# Altium schematic sheet Urukul_Supply.SchDoc: Fastino (part 1 of 2)
size 420 x 297 mm; EDA_Number: ARTIQ; Projet: Zotino; Author: G.Kasprowicz; CompanyName: WUT ISE; DrawnBy: G.Kasprowicz; Organization: WUT ISE; Address1: PW ISE; Address2: Nowowiejska 15/19 00-665 Warsaw; Address3: gkasprow@gmail.com; DocumentNumber: 7; Revision: 2; SheetNumber: 3; SheetTotal: 11; ModifiedBy: -; CheckedDate: -; Title2: Power Supply; DivGrp: WUT ISE; Designer: G.Kasprowicz; SPICEModelCacheRGNJYCWR: <root> / <DocumentId>RGNJYCWR</DocumentId> / </root>; ModifiedDate: -; ProjectName: Sensor Box
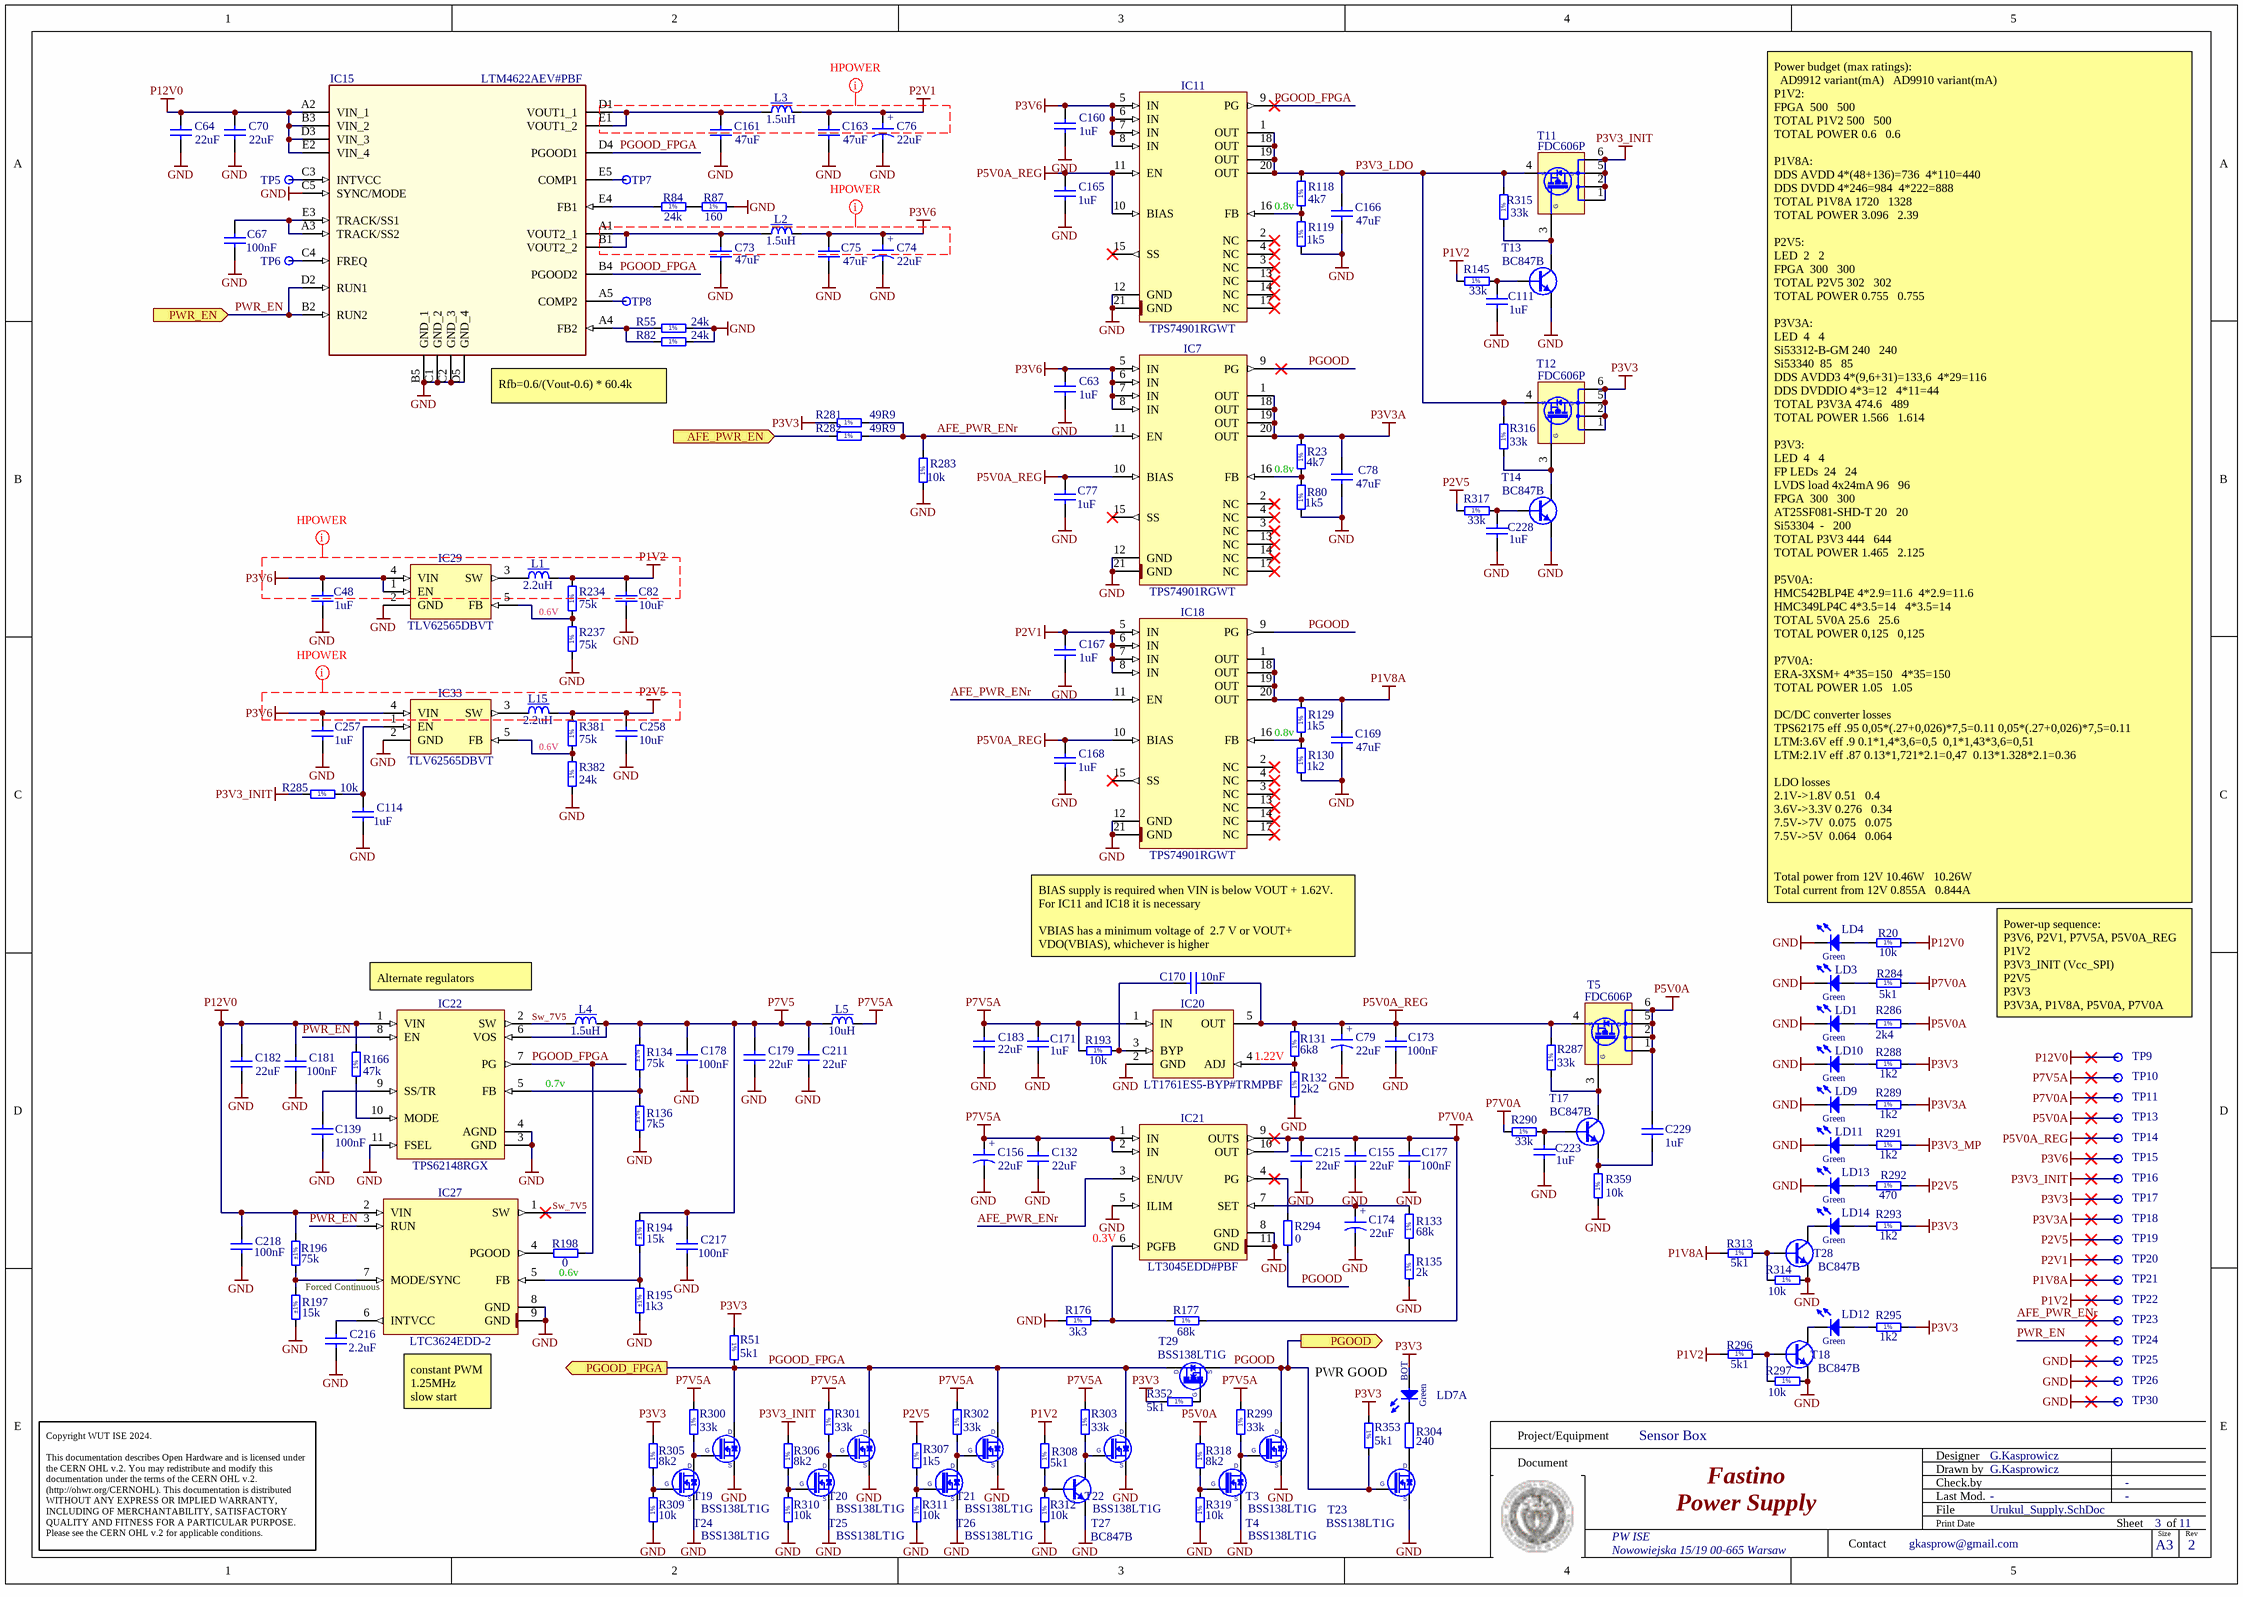
[diagram p0: Urukul_Supply.SchDoc]

## Parts
C48  1uF  [CAPC1005X55N]
C63  1uF  [CAPC1005X55N]
C64  22uF  [CAPC2012X135N]
C67  100nF  [CAPC1005X55N]
C70  22uF  [CAPC2012X135N]
C73  47uF  [CAPC3225X270N]
C74  22uF  [CAPMP3528X210N]
C75  47uF  [CAPC3225X270N]
C76  22uF  [CAPMP3528X210N]
C77  1uF  [CAPC1005X55N]
C78  47uF  [CAPC3225X270N]
C79  22uF  [CAPMP3528X210N]
C82  10uF  [CAPC2012X135N]
C111  1uF  [CAPC1608X87N]
C114  1uF  [CAPC1608X87N]
C132  22uF  [CAPC2012X135N]
C139  100nF  [CAPC1005X55N]
C155  22uF  [CAPC2012X135N]
C156  22uF  [CAPMP3528X210N]
C160  1uF  [CAPC1005X55N]
C161  47uF  [CAPC3225X270N]
C163  47uF  [CAPC3225X270N]
C165  1uF  [CAPC1005X55N]
C166  47uF  [CAPC3225X270N]
C167  1uF  [CAPC1005X55N]
C168  1uF  [CAPC1005X55N]
C169  47uF  [CAPC3225X270N]
C170  10nF  [CAPC1005X55N]
C171  1uF  [CAPC1005X55N]
C173  100nF  [CAPC1005X55N]
C174  22uF  [CAPMP3528X210N]
C177  100nF  [CAPC1005X55N]
C178  100nF  [CAPC1005X55N]
C179  22uF  [CAPC2012X135N]
C181  100nF  [CAPC1005X55N]
C182  22uF  [CAPC2012X135N]
C183  22uF  [CAPC2012X135N]
C211  22uF  [CAPC2012X135N]
C215  22uF  [CAPC2012X135N]
C216  2.2uF  [CAPC1005X55N]
C217  100nF  [CAPC1005X55N]
C218  100nF  [CAPC1005X55N]
C223  1uF  [CAPC1608X87N]
C228  1uF  [CAPC1608X87N]
C229  1uF  [CAPC1005X55N]
C257  1uF  [CAPC1005X55N]
C258  10uF  [CAPC2012X135N]
IC7  TPS74901RGWT  [QFN65P500X500X100-21N-S325]
IC11  TPS74901RGWT  [QFN65P500X500X100-21N-S325]
IC15  LTM4622AEV#PBF  [LGA25C127P5X5_625X625X190]
IC18  TPS74901RGWT  [QFN65P500X500X100-21N-S325]
IC20  LT1761ES5-BYP#TRMPBF  [SOT95P280X100-5N]
IC21  LT3045EDD#PBF  [SON50P300X300X80-11N-R175X248]
IC22  TPS62148RGX  [TEXAS_RGX0011A]
IC27  LTC3624EDD-2  [SON50P300X300X80-9N-R175X248]
IC29  TLV62565DBVT  [SOT95P280X145-5N]
IC33  TLV62565DBVT  [SOT95P280X145-5N]
L1  2.2uH  [IND_MURATA_LQH44PN_P0]
L2  1.5uH  [IND_TDK_SPM6530]
L3  1.5uH  [IND_TDK_SPM6530]
L4  1.5uH  [IND_TDK_SPM6530]
L5  10uH  [IND_MURATA-PS_8400]
L15  2.2uH  [IND_MURATA_LQH44PN_P0]
LD1  Green  [LED_KINGBRIGHT_KPH-1608CGCK]
LD3  Green  [LED_KINGBRIGHT_KPH-1608CGCK]
LD4  Green  [LED_KINGBRIGHT_KPH-1608CGCK]
LD7  Red/Green  [LED_DIALIGHT_571-0112F]  (value not drawn)  (part A of 2)
LD9  Green  [LED_KINGBRIGHT_KPH-1608CGCK]
LD10  Green  [LED_KINGBRIGHT_KPH-1608CGCK]
LD11  Green  [LED_KINGBRIGHT_KPH-1608CGCK]
LD12  Green  [LED_KINGBRIGHT_KPH-1608CGCK]
LD13  Green  [LED_KINGBRIGHT_KPH-1608CGCK]
LD14  Green  [LED_KINGBRIGHT_KPH-1608CGCK]
R20  10k  [RESC1005X40N]
R23  4k7  [RESC1608X55N]
R51  5k1  [RESC1005X40N]
R55  24k  [RESC1608X55N]
R80  1k5  [RESC1608X55N]
R82  24k  [RESC1608X55N]
R84  24k  [RESC1608X55N]
R87  160  [RESC1608X55N]
R118  4k7  [RESC1608X55N]
R119  1k5  [RESC1608X55N]
R129  1k5  [RESC1608X55N]
R130  1k2  [RESC1608X55N]
R131  6k8  [RESC1608X55N]
R132  2k2  [RESC1608X55N]
R133  68k  [RESC1005X40N]
R134  75k  Tolerance: ±1%  [RESC1608X55N]
R135  2k  [RESC1005X40N]
R136  7k5  Tolerance: ±1%  [RESC1608X55N]
R145  33k  [RESC1005X40N]
R166  47k  [RESC1608X55N]
R176  3k3  [RESC1608X55N]
R177  68k  [RESC1005X40N]
R193  10k  [RESC1005X40N]
R194  15k  Tolerance: ±1%  [RESC1005X40N]
R195  1k3  Tolerance: ±1%  [RESC1005X40N]
R196  75k  Tolerance: ±1%  [RESC1005X40N]
R197  15k  Tolerance: ±1%  [RESC1005X40N]
R198  0  [RESC1005X40N]
R234  75k  [RESC1005X40N]
R237  75k  [RESC1005X40N]
R281  49R9  [RESC1005X40N]
R282  49R9  [RESC1005X40N]
R283  10k  [RESC1005X40N]
R284  5k1  [RESC1005X40N]
R285  10k  [RESC1005X40N]
R286  2k4  [RESC1005X40N]
R287  33k  [RESC1005X40N]
R288  1k2  [RESC1608X55N]
R289  1k2  [RESC1608X55N]
R290  33k  [RESC1005X40N]
R291  1k2  [RESC1608X55N]
R292  470  [RESC1608X55N]
R293  1k2  [RESC1608X55N]
R294  0  [RESC1005X40N]
R295  1k2  [RESC1608X55N]
R296  5k1  [RESC1005X40N]
R297  10k  [RESC1005X40N]
R299  33k  [RESC1005X40N]
R300  33k  [RESC1005X40N]
R301  33k  [RESC1005X40N]
R302  33k  [RESC1005X40N]
R303  33k  [RESC1005X40N]
R304  240  [RESC1005X40N]
R305  8k2  [RESC1005X40N]
R306  8k2  [RESC1005X40N]
R307  1k5  [RESC1608X55N]
R308  5k1  [RESC1005X40N]
R309  10k  [RESC1005X40N]
R310  10k  [RESC1005X40N]
R311  10k  [RESC1005X40N]
R312  10k  [RESC1005X40N]
R313  5k1  [RESC1005X40N]
R314  10k  [RESC1005X40N]
R315  33k  [RESC1005X40N]
R316  33k  [RESC1005X40N]
R317  33k  [RESC1005X40N]
R318  8k2  [RESC1005X40N]
R319  10k  [RESC1005X40N]
R352  5k1  [RESC1005X40N]
R353  5k1  [RESC1005X40N]
R359  10k  [RESC1005X40N]
R381  75k  [RESC1005X40N]
R382  24k  [RESC1005X40N]
T3  BSS138LT1G  [SOT95P240X110-3N]
T4  BSS138LT1G  [SOT95P240X110-3N]
T5  FDC606P  [SOT95P275X110-6N]
T11  FDC606P  [SOT95P275X110-6N]
T12  FDC606P  [SOT95P275X110-6N]
T13  BC847B  [SOT95P230X110-3N]
T14  BC847B  [SOT95P230X110-3N]
T17  BC847B  [SOT95P230X110-3N]
T18  BC847B  [SOT95P230X110-3N]
T19  BSS138LT1G  [SOT95P240X110-3N]
T20  BSS138LT1G  [SOT95P240X110-3N]
T21  BSS138LT1G  [SOT95P240X110-3N]
T22  BSS138LT1G  [SOT95P240X110-3N]
T23  BSS138LT1G  [SOT95P240X110-3N]
T24  BSS138LT1G  [SOT95P240X110-3N]
T25  BSS138LT1G  [SOT95P240X110-3N]
T26  BSS138LT1G  [SOT95P240X110-3N]
T27  BC847B  [SOT95P230X110-3N]
T28  BC847B  [SOT95P230X110-3N]
T29  BSS138LT1G  [SOT95P240X110-3N]
TP5  Test Point  [TPS127]  (value not drawn)  (no BOM)
TP6  Test Point  [TPS127]  (value not drawn)  (no BOM)
TP7  Test Point  [TPS127]  (value not drawn)  (no BOM)
TP8  Test Point  [TPS127]  (value not drawn)  (no BOM)
TP9  Test Point  [TPS127]  (value not drawn)  (no BOM)
TP10  Test Point  [TPS127]  (value not drawn)  (no BOM)
TP11  Test Point  [TPS127]  (value not drawn)  (no BOM)
TP13  Test Point  [TPS127]  (value not drawn)  (no BOM)
TP14  Test Point  [TPS127]  (value not drawn)  (no BOM)
TP15  Test Point  [TPS127]  (value not drawn)  (no BOM)
TP16  Test Point  [TPS127]  (value not drawn)  (no BOM)
TP17  Test Point  [TPS127]  (value not drawn)  (no BOM)
TP18  Test Point  [TPS127]  (value not drawn)  (no BOM)
TP19  Test Point  [TPS127]  (value not drawn)  (no BOM)
TP20  Test Point  [TPS127]  (value not drawn)  (no BOM)
TP21  Test Point  [TPS127]  (value not drawn)  (no BOM)
TP22  Test Point  [TPS127]  (value not drawn)  (no BOM)
TP23  Test Point  [TPS127]  (value not drawn)  (no BOM)
TP24  Test Point  [TPS127]  (value not drawn)  (no BOM)
TP25  Test Point  [TPS127]  (value not drawn)  (no BOM)
TP26  Test Point  [TPS127]  (value not drawn)  (no BOM)
TP30  Test Point  [TPS127]  (value not drawn)  (no BOM)

## Ports
AFE_PWR_EN (in), PGOOD (out), PGOOD_FPGA (out), PWR_EN (in)

## Nets
GND: C48.1 C63.2 C64.1 C67.1 C70.1 C73.1 C74.2 C75.1 C76.2 C77.1 C78.1 C79.2 C82.2 C111.1 C114.1 C132.1 C139.2 C155.1 C156.2 C160.2 C161.1 C163.1 C165.1 C166.1 C167.2 C168.1 C169.1 C171.1 C173.1 C174.2 C177.1 C178.1 C179.1 C181.1 C182.1 C183.1 C211.1 C215.1 C216.1 C217.1 C218.1 C223.1 C228.1 C257.1 C258.2 IC7.12(GND) IC7.21(GND) IC11.12(GND) IC11.21(GND) IC15.B5(GND_1) IC15.C1(GND_2) IC15.C2(GND_3) IC15.C5(SYNC/MODE) IC15.D5(GND_4) IC18.12(GND) IC18.21(GND) IC20.2(GND) IC21.5(ILIM) IC21.8(GND) IC21.11(GND) IC22.3(GND) IC22.4(AGND) IC22.11(FSEL) IC27.8(GND) IC27.9(GND) IC29.2(GND) IC33.2(GND) LD1.1(C) LD3.1(C) LD4.1(C) LD9.1(C) LD10.1(C) LD11.1(C) LD13.1(C) R55.2 R80.1 R82.2 R87.2 R119.1 R130.1 R132.1 R135.1 R136.1 R176.1 R195.1 R197.1 R237.1 R283.1 R297.2 R309.1 R310.1 R311.1 R312.1 R314.2 R319.1 R359.1 R382.1 T3.2(S) T4.2(S) T13.2(E) T14.2(E) T18.2(E) T19.2(S) T20.2(S) T21.2(S) T22.2(S) T23.2(S) T24.2(S) T25.2(S) T26.2(S) T27.2(E) T28.2(E) TP25.1 TP26.1 TP30.1
P1V2: C82.1 L1.2 R145.1 R234.2 R296.1 R308.2 TP22.1
P1V8A: C169.2 IC18.1(OUT) IC18.18(OUT) IC18.19(OUT) IC18.20(OUT) R129.2 R313.1 TP21.1
P2V1: C76.1 C163.2 C167.1 IC18.5(IN) IC18.6(IN) IC18.7(IN) IC18.8(IN) L3.2 TP20.1
P2V5: C258.1 L15.2 R292.2 R307.2 R317.1 R381.2 TP19.1
P3V3: LD7.2(A) R51.1 R281.1 R288.2 R293.2 R295.2 R305.2 R352.1 R353.1 T12.1(D) T12.2(D) T12.5(D) T12.6(D) TP17.1
P3V3_INIT: R285.1 R306.2 T11.1(D) T11.2(D) T11.5(D) T11.6(D) TP16.1
P3V3_MP: R291.2
P3V3A: C78.2 IC7.1(OUT) IC7.18(OUT) IC7.19(OUT) IC7.20(OUT) R23.2 R289.2 TP18.1
P3V6: C48.2 C63.1 C74.1 C75.2 C160.1 C257.2 IC7.5(IN) IC7.6(IN) IC7.7(IN) IC7.8(IN) IC11.5(IN) IC11.6(IN) IC11.7(IN) IC11.8(IN) IC29.1(EN) IC29.4(VIN) IC33.4(VIN) L2.2 TP15.1
P5V0A: C229.1 R286.2 R318.2 T5.1(D) T5.2(D) T5.5(D) T5.6(D) TP13.1
P5V0A_REG: C77.2 C79.1 C165.2 C168.2 C170.2 C173.2 IC7.10(BIAS) IC11.10(BIAS) IC11.11(EN) IC18.10(BIAS) IC20.5(OUT) R131.2 R287.2 T5.4(S) TP14.1
P7V0A: C155.2 C177.2 C215.2 IC21.9(OUTS) IC21.10(OUT) R177.2 R284.2 R290.1 TP11.1
P7V5: C178.2 C179.2 C211.2 C217.2 IC22.6(VOS) L4.2 L5.1 R134.2 R194.2
P7V5A: C132.2 C156.1 C171.2 C183.2 IC20.1(IN) IC21.1(IN) IC21.2(IN) L5.2 R193.1 R299.2 R300.2 R301.2 R302.2 R303.2 TP10.1
P12V0: C64.2 C70.2 C181.2 C182.2 C218.2 IC15.A2(VIN_1) IC15.B3(VIN_2) IC15.D3(VIN_3) IC15.E2(VIN_4) IC22.1(VIN) IC27.2(VIN) R20.2 R166.2 R196.2 TP9.1
AFE_PWR_EN: R282.1 ; port AFE_PWR_EN
AFE_PWR_ENr: IC7.11(EN) IC18.11(EN) IC21.3(EN/UV) R281.2 R282.2 R283.2 TP23.1
P3V3_LDO: C166.2 IC11.1(OUT) IC11.18(OUT) IC11.19(OUT) IC11.20(OUT) R118.2 R315.2 R316.2 T11.4(S) T12.4(S)
PGOOD: IC7.9(PG) IC18.9(PG) R294.1 R353.2 T3.3(D) T23.1(G) T29.2(S) ; port PGOOD
PGOOD_FPGA: IC11.9(PG) IC15.B4(PGOOD2) IC15.D4(PGOOD1) IC22.7(PG) R51.2 R198.2 T19.3(D) T20.3(D) T21.3(D) T22.3(D) T29.3(D) ; port PGOOD_FPGA
PWR_EN: IC15.B2(RUN2) IC15.D2(RUN1) IC22.8(EN) IC27.3(RUN) TP24.1 ; port PWR_EN
Sw_7V5: IC22.2(SW) IC27.1(SW) L4.1
NetC67_2: C67.2 IC15.A3(TRACK/SS2) IC15.E3(TRACK/SS1)
NetC73_2: C73.2 IC15.A1(VOUT2_1) IC15.B1(VOUT2_2) L2.1
NetC111_2: C111.2 R145.2 T13.1(B)
NetC114_2: C114.2 IC33.1(EN) R285.2
NetC139_1: C139.1 IC22.9(SS/TR)
NetC161_2: C161.2 IC15.D1(VOUT1_1) IC15.E1(VOUT1_2) L3.1
NetC170_1: C170.1 IC20.3(BYP) R193.2
NetC174_1: C174.1 IC21.7(SET) R133.2
NetC216_2: C216.2 IC27.6(INTVCC)
NetC223_2: C223.2 R290.2 T17.1(B)
NetC228_2: C228.2 R317.2 T14.1(B)
NetC229_2: C229.2 R359.2 T17.2(E)
NetIC7_16: IC7.16(FB) R23.1 R80.2
NetIC11_16: IC11.16(FB) R118.1 R119.2
NetIC15_A4: IC15.A4(FB2) R55.1 R82.1
NetIC15_A5: IC15.A5(COMP2) TP8.1
NetIC15_C3: IC15.C3(INTVCC) TP5.1
NetIC15_C4: IC15.C4(FREQ) TP6.1
NetIC15_E4: IC15.E4(FB1) R84.1
NetIC15_E5: IC15.E5(COMP1) TP7.1
NetIC18_16: IC18.16(FB) R129.1 R130.2
NetIC20_4: IC20.4(ADJ) R131.1 R132.2
NetIC21_4: IC21.4(PG) R294.2
NetIC21_6: IC21.6(PGFB) R176.2 R177.1
NetIC22_5: IC22.5(FB) R134.1 R136.2
NetIC22_10: IC22.10(MODE) R166.1
NetIC27_4: IC27.4(PGOOD) R198.1
NetIC27_5: IC27.5(FB) R194.1 R195.2
NetIC27_7: IC27.7(MODE/SYNC) R196.1 R197.2
NetIC29_3: IC29.3(SW) L1.1
NetIC29_5: IC29.5(FB) R234.1 R237.2
NetIC33_3: IC33.3(SW) L15.1
NetIC33_5: IC33.5(FB) R381.1 R382.2
NetLD1_2: LD1.2(A) R286.1
NetLD3_2: LD3.2(A) R284.1
NetLD4_2: LD4.2(A) R20.1
NetLD7_1: LD7.1(C) R304.2
NetLD9_2: LD9.2(A) R289.1
NetLD10_2: LD10.2(A) R288.1
NetLD11_2: LD11.2(A) R291.1
NetLD12_1: LD12.1(C) T18.3(C)
NetLD12_2: LD12.2(A) R295.1
NetLD13_2: LD13.2(A) R292.1
NetLD14_1: LD14.1(C) T28.3(C)
NetLD14_2: LD14.2(A) R293.1
NetR84_2: R84.2 R87.1
NetR133_1: R133.1 R135.2
NetR287_1: R287.1 T5.3(S) T17.3(C)
NetR296_2: R296.2 R297.1 T18.1(B)
NetR299_1: R299.1 T3.1(G) T4.3(D)
NetR300_1: R300.1 T19.1(G) T24.3(D)
NetR301_1: R301.1 T20.1(G) T25.3(D)
NetR302_1: R302.1 T21.1(G) T26.3(D)
NetR303_1: R303.1 T22.1(G) T27.3(C)
NetR304_1: R304.1 T23.3(D)
NetR305_1: R305.1 R309.2 T24.1(G)
NetR306_1: R306.1 R310.2 T25.1(G)
NetR307_1: R307.1 R311.2 T26.1(G)
NetR308_1: R308.1 R312.2 T27.1(B)
NetR313_2: R313.2 R314.1 T28.1(B)
NetR315_1: R315.1 T11.3(S) T13.3(C)
NetR316_1: R316.1 T12.3(S) T14.3(C)
NetR318_1: R318.1 R319.2 T4.1(G)
NetR352_2: R352.2 T29.1(G)

Not connected (* = marked no-connect by the designer): IC7 2(NC)* 3(NC)* 4(NC)* 13(NC)* 14(NC)* 15(SS)* 17(NC)*; IC11 2(NC)* 3(NC)* 4(NC)* 13(NC)* 14(NC)* 15(SS)* 17(NC)*; IC18 2(NC)* 3(NC)* 4(NC)* 13(NC)* 14(NC)* 15(SS)* 17(NC)*

## Layout directives
net class Hpower: P1V2, P2V1, P2V5, P3V6

## Notes on the sheet
- 0.8v
- (near IC15) Rfb=0.6/(Vout-0.6) * 60.4k
- 0.6V
- Power budget (max ratings):
  AD9912 variant(mA)	 	AD9910 variant(mA)
  P1V2:
  FPGA		500			500
  TOTAL P1V2	500			500
  TOTAL POWER	0.6			0.6
  P1V8A:
  DDS AVDD	4*(48+136)=736		4*110=440
  DDS DVDD	4*246=984		4*222=888
  TOTAL P1V8A	1720			1328
  TOTAL POWER	3.096			2.39
  P2V5:
  LED		2			2
  FPGA		300			300
  TOTAL P2V5	302			302
  TOTAL POWER	0.755			0.755
  P3V3A:
  LED		4			4
  Si53312-B-GM	240			240
  Si53340		85			85
  DDS AVDD3	4*(9,6+31)=133,6		4*29=116
  DDS DVDDIO	4*3=12			4*11=44
  TOTAL P3V3A	474.6			489
  TOTAL POWER	1.566			1.614
  P3V3:
  LED		4			4
  FP LEDs		24			24
  LVDS load 4x24mA	96			96
  FPGA		300			300
  AT25SF081-SHD-T	20			20
  Si53304		-			200
  TOTAL P3V3	444			644
  TOTAL POWER	1.465			2.125
  P5V0A:
  HMC542BLP4E	4*2.9=11.6		4*2.9=11.6
  HMC349LP4C	4*3.5=14			4*3.5=14
  TOTAL 5V0A	25.6			25.6
  TOTAL POWER	0,125			0,125
  P7V0A:
  ERA-3XSM+	4*35=150			4*35=150
  TOTAL POWER	1.05			1.05
  DC/DC converter losses
  TPS62175 eff .95	0,05*(.27+0,026)*7,5=0.11	0,05*(.27+0,026)*7,5=0.11
  LTM:3.6V eff .9	0.1*1,4*3,6=0,5		0,1*1,43*3,6=0,51
  LTM:2.1V eff .87	0.13*1,721*2.1=0,47		0.13*1.328*2.1=0.36
  LDO losses
  2.1V->1.8V	0.51			0.4
  3.6V->3.3V	0.276			0.34
  7.5V->7V		0.075			0.075
  7.5V->5V		0.064			0.064
  Total power from 12V 10.46W			10.26W
  Total current from 12V 0.855A			0.844A
- (near IC22) Alternate regulators
- BIAS supply is required when VIN is below VOUT + 1.62V.
  For IC11 and IC18 it is necessary
  VBIAS has a minimum voltage of  2.7 V or VOUT+ VDO(VBIAS), whichever is higher
- 1.22V
- Power-up sequence:
  P3V6, P2V1, P7V5A, P5V0A_REG
  P1V2
  P3V3_INIT (Vcc_SPI)
  P2V5
  P3V3
  P3V3A, P1V8A, P5V0A, P7V0A
- 0.7v
- (near IC21) 0.3V
- (near IC27) Forced Continuous
- (near R198) 0.6v
- (near IC27) constant PWM
  1.25MHz
  slow start
- PWR GOOD
- Project/Equipment
- Document
- Designer
- Drawn by
- Check.by
- Copyright WUT ISE 2024.
  This documentation describes Open Hardware and is licensed under the CERN OHL v.2. You may redistribute and modify this documentation under the terms of the CERN OHL v.2. (http://ohwr.org/CERNOHL). This documentation is distributed WITHOUT ANY EXPRESS OR IMPLIED WARRANTY, INCLUDING OF MERCHANTABILITY, SATISFACTORY QUALITY AND FITNESS FOR A PARTICULAR PURPOSE. Please see the CERN OHL v.2 for applicable conditions.
- Contact
- File
- Last Mod.
- Print Date
- Sheet
- Size
- A3
- of
- Rev
- (in symbol CTE3528-21_22UF_10V_10%_LESR0700) +
- (in symbol FDC606P) G
- (in symbol LED_DIALIGHT_571-0112F, part A) BOT; Green
- (in symbol R0402_2K4_1%_0.0625W_100PPM) 1%
- (in symbol R0402_2K_1%_0.0625W_100PPM) 1%
- (in symbol R0402_5K1_1%_0.0625W_100PPM) 1%
- (in symbol R0402_8K2_1%_0.0625W_100PPM) 1%
- (in symbol R0402_10K_1%_0.0625W_100PPM) 1%
- (in symbol R0402_24K_1%_0.0625W_100PPM) 1%
- (in symbol R0402_33K_1%_0.0625W_100PPM) 1%
- (in symbol R0402_49R9_1%_0.0625W_100PPM) 1%
- (in symbol R0402_68K_1%_0.0625W_100PPM) 1%
- (in symbol R0402_75K_1%_0.0625W_100PPM) 1%
- (in symbol R0603_1K2_1%_0.1W_100PPM) 1%
- (in symbol R0603_1K5_1%_0.1W_100PPM) 1%
- (in symbol R0603_2K2_1%_0.1W_100PPM) 1%
- (in symbol R0603_3K3_1%_0.1W_100PPM) 1%
- (in symbol R0603_4K7_1%_0.1W_100PPM) 1%
- (in symbol R0603_6K8_1%_0.1W_100PPM) 1%
- (in symbol R0603_24K_1%_0.1W_100PPM) 1%
- (in symbol R0603_47K_1%_0.1W_100PPM) 1%
- (in symbol R0603_160R_1%_0.1W_100PPM) 1%
- (in symbol R0603_470R_1%_0.1W_100PPM) 1%